# EasyEDA schematic SCH_Placa-Central-Drone_2026-04-25.json
TITLE: Power Distribution Board; REV: 1.0; Date: 2026-04-23; Sheet: 1/1; Company: -
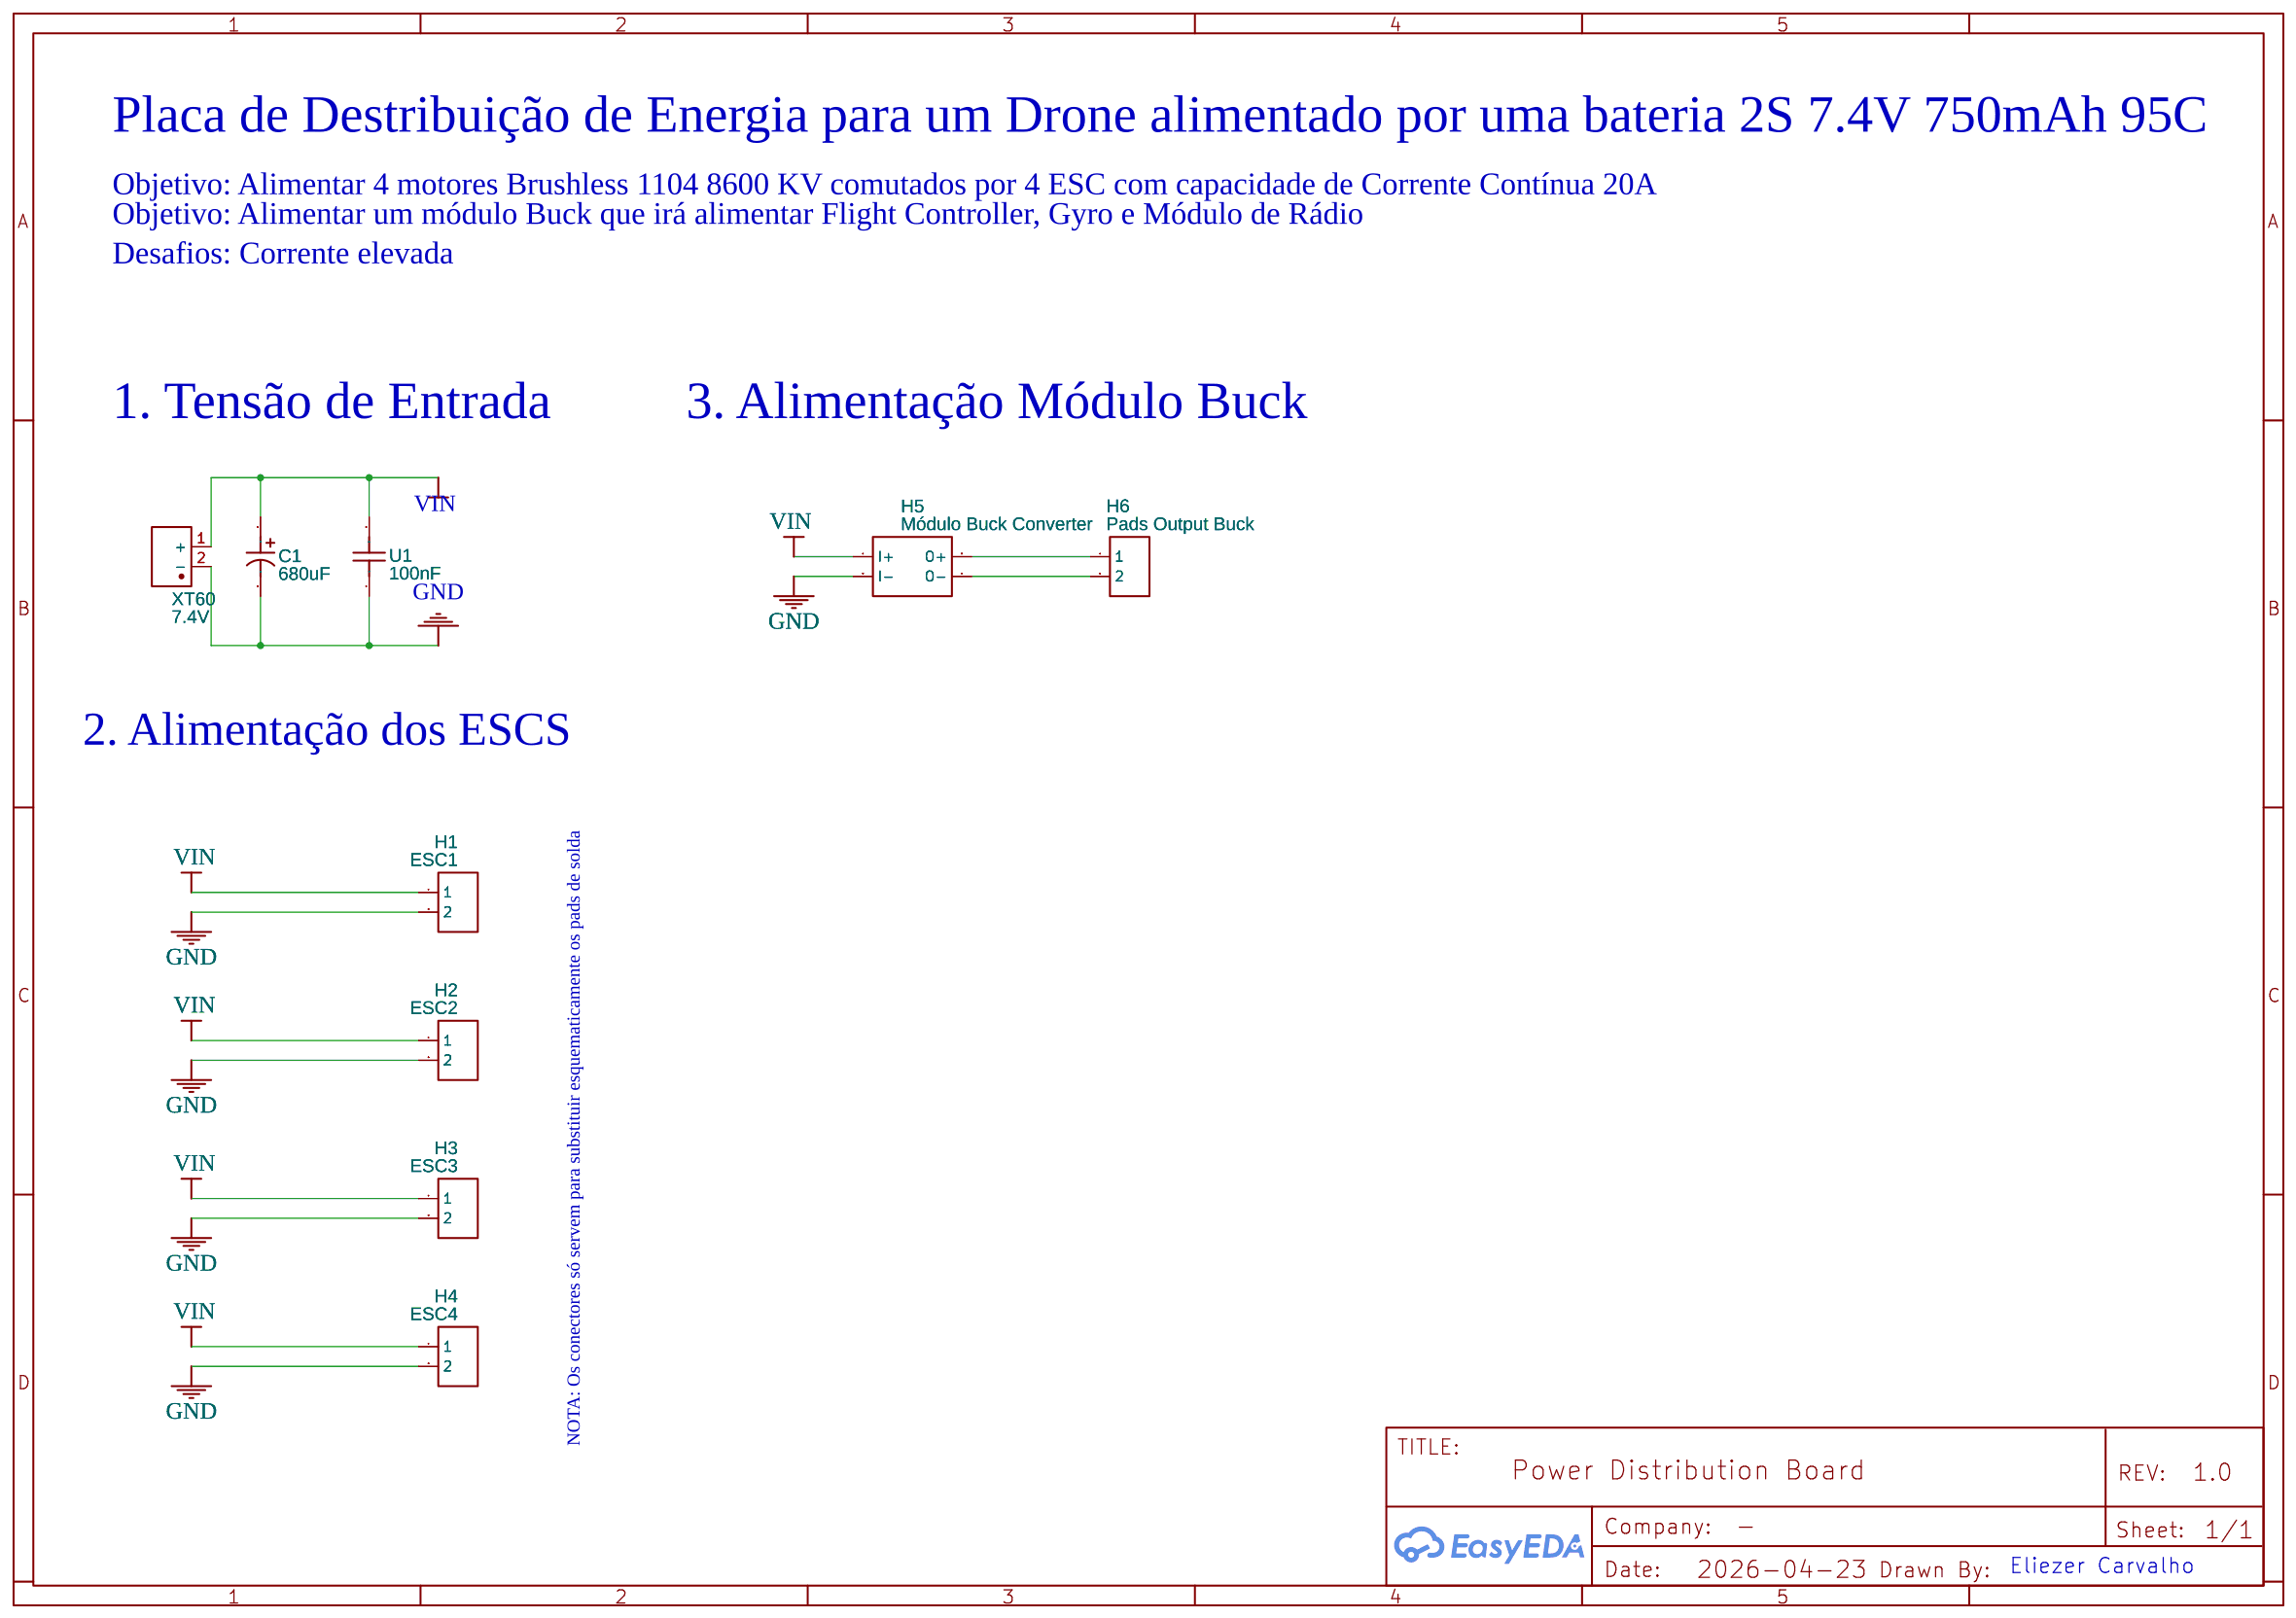
[diagram p0: schematic sheet]

## Parts
7.4V  XT60  [CONN-TH_XT60]
C1  680uF  [CAP-TH_BD10.0-P5.00-D0.6-FD]
H1  ESC1  [HDR-F-2.54_1X2]
H2  ESC2  [HDR-F-2.54_1X2]
H3  ESC3  [HDR-F-2.54_1X2]
H4  ESC4  [HDR-F-2.54_1X2]
H5  Módulo Buck Converter  [HDR-F-2.54_2X2]
H6  Pads Output Buck  [HDR-F-2.54_1X2]
U1  100nF  [CAP-TH_L4.8-W2.4-P5.08-D0.6]

## Library data of the parts
7.4V = XT60: Contributor: lcsc; Supplier: LCSC; Supplier Part: C98733; Manufacturer: AMASS(艾迈斯); Manufacturer Part: XT60-M.; JLCPCB Part Class: Extended Part
C1 = ENB1EM471G13OTH: Contributor: lcsc; Supplier: LCSC; Supplier Part: C724508; Manufacturer: https://mauser.pt/004-1414/condensador-electrolitico-low-esr-680uf-25v-105-10x16mm; JLCPCB Part Class: Extended Part
H1-H4 H6 = HDR-F-2.54_1x2: Supplier Part: C49661; Supplier: LCSC; Contributor: LCEDA_Lib
H5 = HDR-F-2.54_2x2: Supplier Part: C239342; Supplier: LCSC; Contributor: LCEDA_Lib
U1 = 178MU0013: Supplier: LCSC; Supplier Part: C5632437; Manufacturer: https://mauser.pt/004-5086/condensador-ceramico-100nf-50v; JLCPCB Part Class: Extended Part; Contributor: lcsc

## Nets
GND: 7.4V.2(-) C1.2 H1.2 H2.2 H3.2 H4.2 H5.3(I-) U1.1
VIN: 7.4V.1(+) C1.1 H1.1 H2.1 H3.1 H4.1 H5.1(I+) U1.2
Net-(H5-2): H5.2(O+) H6.1
Net-(H5-4): H5.4(O-) H6.2

## Notes on the sheet
- Placa de Destribuição de Energia para um Drone alimentado por uma bateria 2S 7.4V 750mAh 95C
- Objetivo: Alimentar 4 motores Brushless 1104 8600 KV comutados por 4 ESC com capacidade de Corrente Contínua 20A
- Objetivo: Alimentar um módulo Buck que irá alimentar Flight Controller, Gyro e Módulo de Rádio
- Desafios: Corrente elevada
- 1. Tensão de Entrada
- 3. Alimentação Módulo Buck
- 2. Alimentação dos ESCS
- NOTA: Os conectores só servem para substituir esquematicamente os pads de solda
- Eliezer Carvalho
